# EAGLE design 2018-07-20 Shutters Signal Isolator (EAGLE 9.1.1)
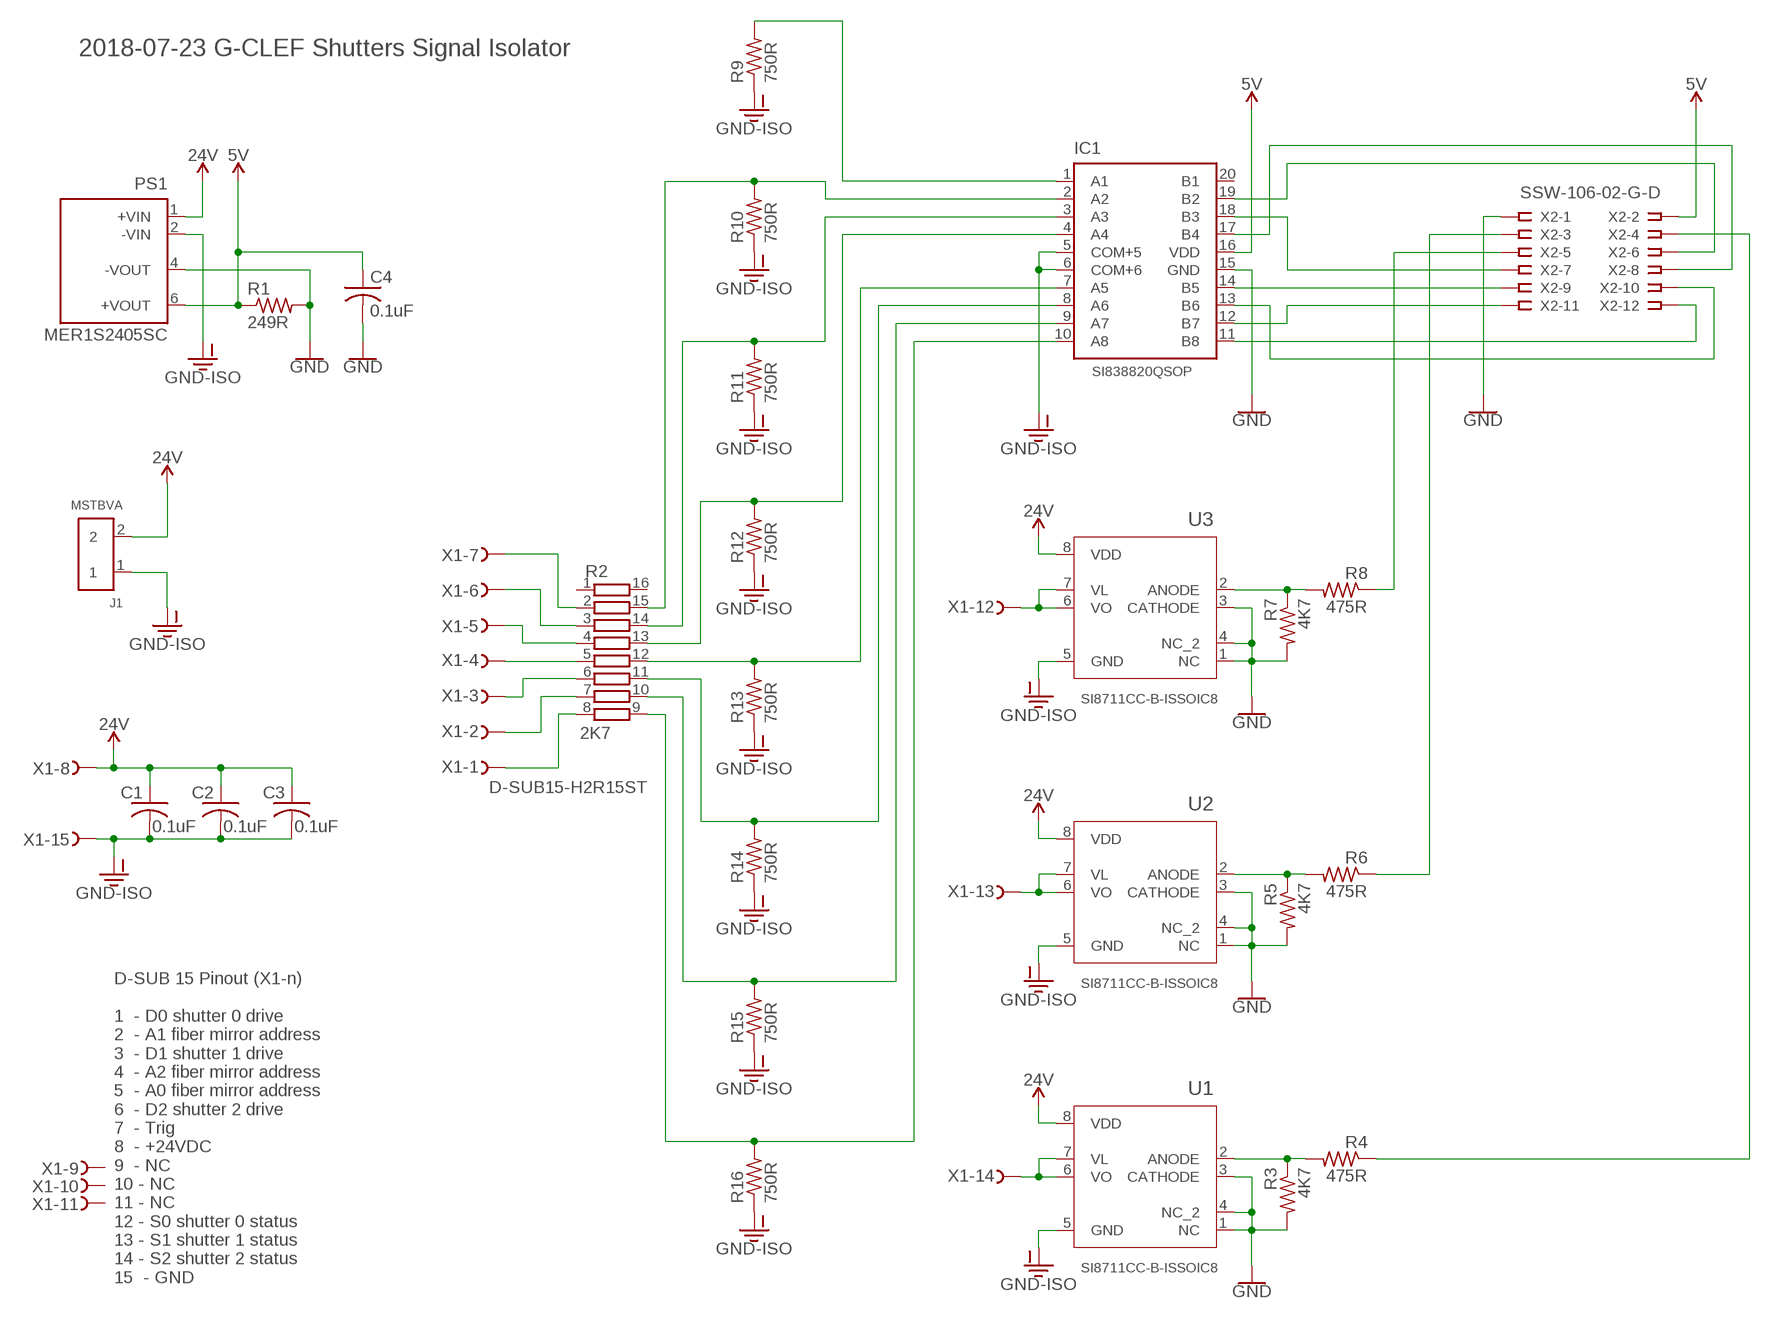
[diagram p0: schematic, sheet 1]

## Parts
C1  0.1uF  C-USC0805  [C0805]
C2  0.1uF  C-USC0805  [C0805]
C3  0.1uF  C-USC0805  [C0805]
C4  0.1uF  C-USC0805  [C0805]
IC1  SI838820QSOP  [SOP63P600X175-20]
J1  MSTBVA  [MSTBVA]
PS1  MER1S2405SC  MER1  [MER1]
R1  249R  R-US_R0805  [R0805]
R2  2K7  BOURNS-RES-ARRAY-4816P-T014816P-1  [SOIC127P765X227-16]
R3  4K7  R-US_R0805  [R0805]
R4  475R  R-US_R0805  [R0805]
R5  4K7  R-US_R0805  [R0805]
R6  475R  R-US_R0805  [R0805]
R7  4K7  R-US_R0805  [R0805]
R8  475R  R-US_R0805  [R0805]
R9  750R  R-US_R0805  [R0805]
R10  750R  R-US_R0805  [R0805]
R11  750R  R-US_R0805  [R0805]
R12  750R  R-US_R0805  [R0805]
R13  750R  R-US_R0805  [R0805]
R14  750R  R-US_R0805  [R0805]
R15  750R  R-US_R0805  [R0805]
R16  750R  R-US_R0805  [R0805]
U1  SI8711CC-B-ISSOIC8  [SOIC127P600X175-8]
U2  SI8711CC-B-ISSOIC8  [SOIC127P600X175-8]
U3  SI8711CC-B-ISSOIC8  [SOIC127P600X175-8]
X1  D-SUB15-H2R15ST  [H2R15ST]
X2  SSW-106-02-G-D  [SSW-106-02-G-D]

## Nets
5V [pwr]: C4.1 IC1.16(VDD) PS1.6(+VOUT) R1.1 X2.2
24V [pwr]: C1.1 C2.1 C3.1 J1.2 PS1.1(+VIN) U1.8(VDD) U2.8(VDD) U3.8(VDD) X1.8
GND: C4.2 IC1.15(GND) PS1.4(-VOUT) R1.2 R3.2 R5.2 R7.2 U1.1(NC) U1.3(CATHODE) U1.4(NC_2) U2.1(NC) U2.3(CATHODE) U2.4(NC_2) U3.1(NC) U3.3(CATHODE) U3.4(NC_2) X2.1
GND-ISO [pwr]: C1.2 C2.2 C3.2 IC1.5(COM+5) IC1.6(COM+6) J1.1 PS1.2(-VIN) R9.1 R10.1 R11.1 R12.1 R13.1 R14.1 R15.1 R16.1 U1.5(GND) U2.5(GND) U3.5(GND) X1.15
N$2: IC1.1(A1) R9.2
N$4: IC1.2(A2) R2.15 R10.2
N$5: IC1.11(B8) X2.12
N$6: IC1.12(B7) X2.11
N$7: IC1.3(A3) R2.14 R11.2
N$8: IC1.13(B6) X2.10
N$9: IC1.14(B5) X2.9
N$10: IC1.19(B2) X2.6
N$11: IC1.17(B4) X2.8
N$12: IC1.18(B3) X2.7
N$13: R2.8 X1.1
N$14: IC1.4(A4) R2.13 R12.2
N$15: R2.7 X1.2
N$16: IC1.7(A5) R2.12 R13.2
N$17: R2.6 X1.3
N$18: IC1.8(A6) R2.11 R14.2
N$21: IC1.9(A7) R2.10 R15.2
N$22: IC1.10(A8) R2.9 R16.2
N$23: R2.5 X1.4
N$24: R2.2 X1.7
N$25: R2.3 X1.6
N$26: R2.4 X1.5
N$27: R6.1 X2.3
N$28: R3.1 R4.2 U1.2(ANODE)
N$30: U1.6(VO) U1.7(VL) X1.14
N$31: R5.1 R6.2 U2.2(ANODE)
N$32: U2.6(VO) U2.7(VL) X1.13
N$33: R7.1 R8.2 U3.2(ANODE)
N$35: U3.6(VO) U3.7(VL) X1.12
S$0: R8.1 X2.5
S$2: R4.1 X2.4
Unconnected: IC1.20(B1) R2.1 R2.16 X1.9 X1.10 X1.11

## Notes on the sheet
- 2018-07-23 G-CLEF Shutters Signal Isolator
- D-SUB 15 Pinout (X1-n)
  
  1  - D0 shutter 0 drive
  2  - A1 fiber mirror address
  3  - D1 shutter 1 drive
  4  - A2 fiber mirror address
  5  - A0 fiber mirror address
  6  - D2 shutter 2 drive
  7  - Trig
  8  - +24VDC
  9  - NC
  10 - NC
  11 - NC
  12 - S0 shutter 0 status
  13 - S1 shutter 1 status
  14 - S2 shutter 2 status
  15  - GND

## Library data of the parts
C1-C4 = rcl:C-US: CAPACITOR, American symbol; SPICEPREFIX: C
IC1 = AUmlib:SI8388: Si8388 Silicon Labs Digital Input 8-port 24V to 5V with isolation
J1 = AU:MSTBVA: Phoenix Contact MSTBVA Vertical Terminal Block Phoenix order number 1755736 Digikey: 277-1150-ND Mating part is Phoneix Contact Combicon Spring Cage plug TFCK 5.08 mm pitch Digikey: 277-6941-ND
PS1 = AU:MER1
R1 R3-R16 = rcl:R-US_: RESISTOR, American symbol; SPICEPREFIX: R
R2 = AUmlib:BOURNS-RES-ARRAY-4816P-T01: BOURNS RESISTOR NETWORK
U1-U3 = AUmlib:SI8711CC-B-IS
X1 = con-thomas-betts:D-SUB15-: D-Subminiatur Connector Source: Electronioc Interconnects European Edition 1998; OC_FARNELL: unknown; OC_NEWARK: unknown
X2 = AUmlib:SSW-106-02-G: THROUGH-HOLE .025" SQ POST SOCKET Source: Samtec SSW.pdf; MF: Samtec Inc.; MPN: SSW-106-02-G-D; OC_FARNELL: unknown; OC_NEWARK: 11P9414

## Net classes
1 pwr: width 0.254 mm, clearance 0.254 mm

## Board
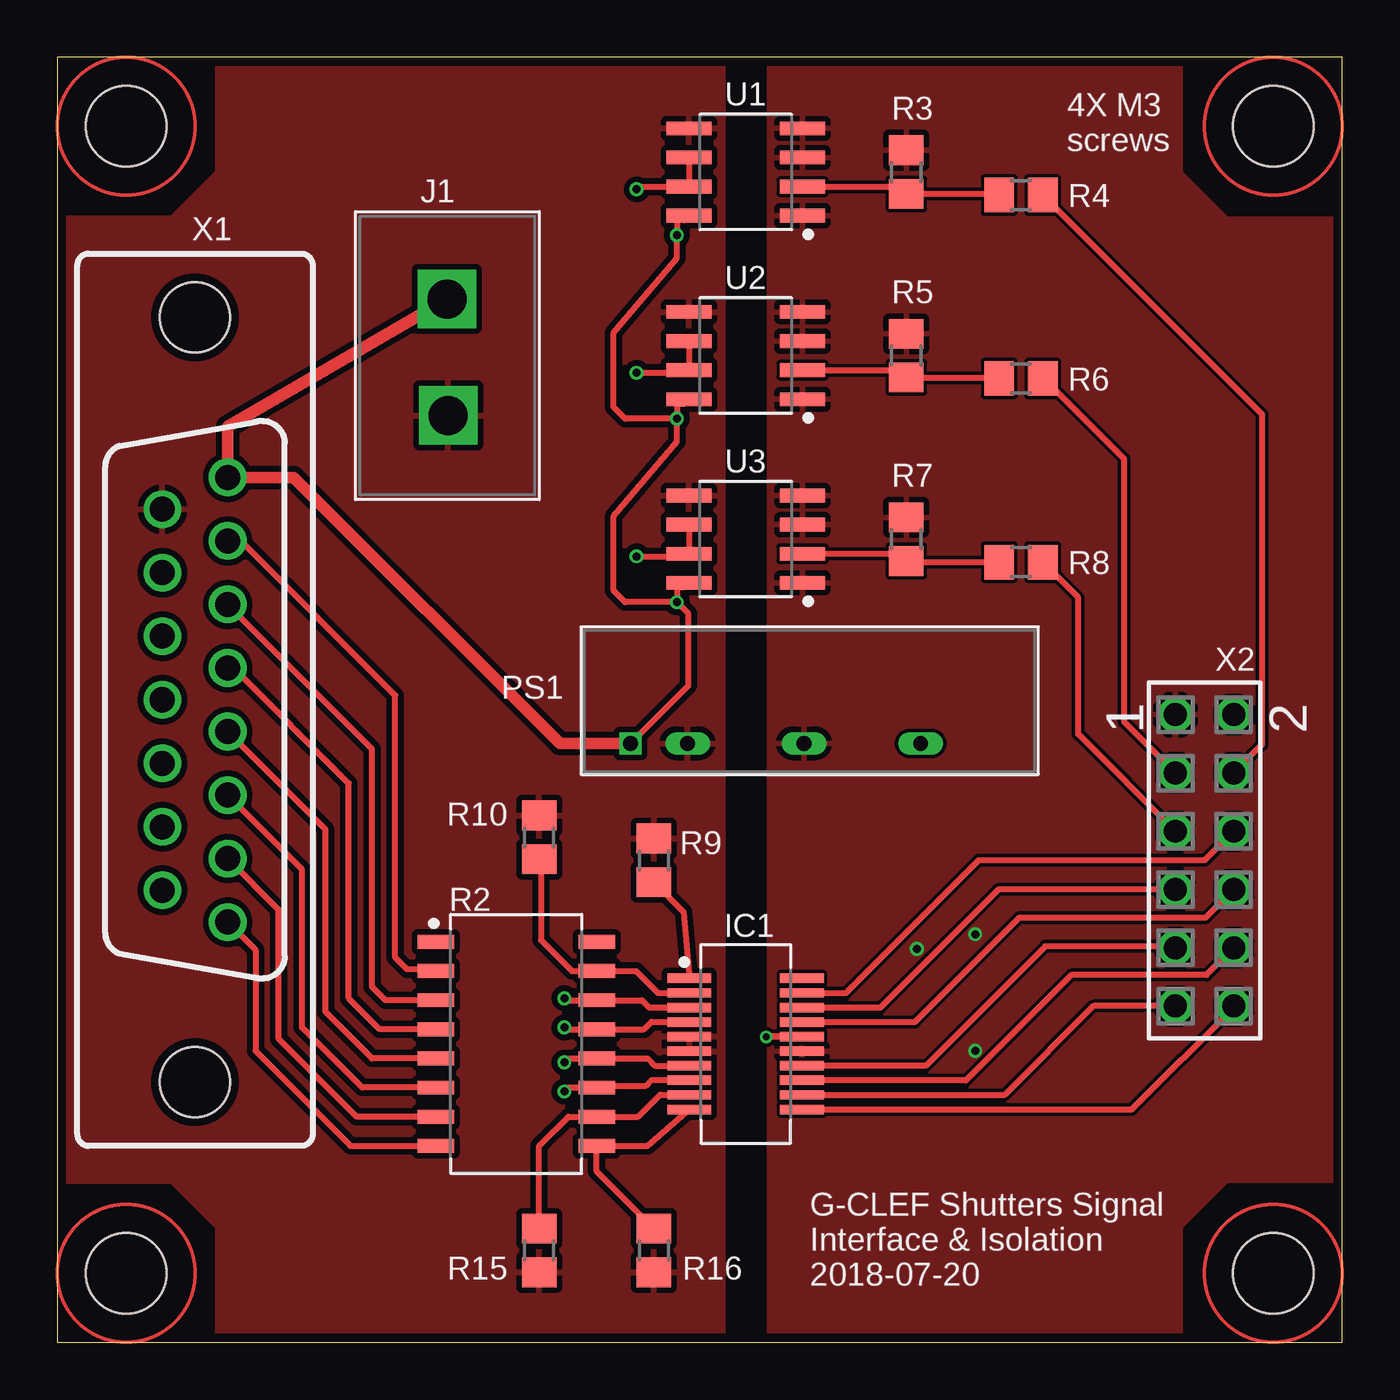
[diagram p1: board, top side]
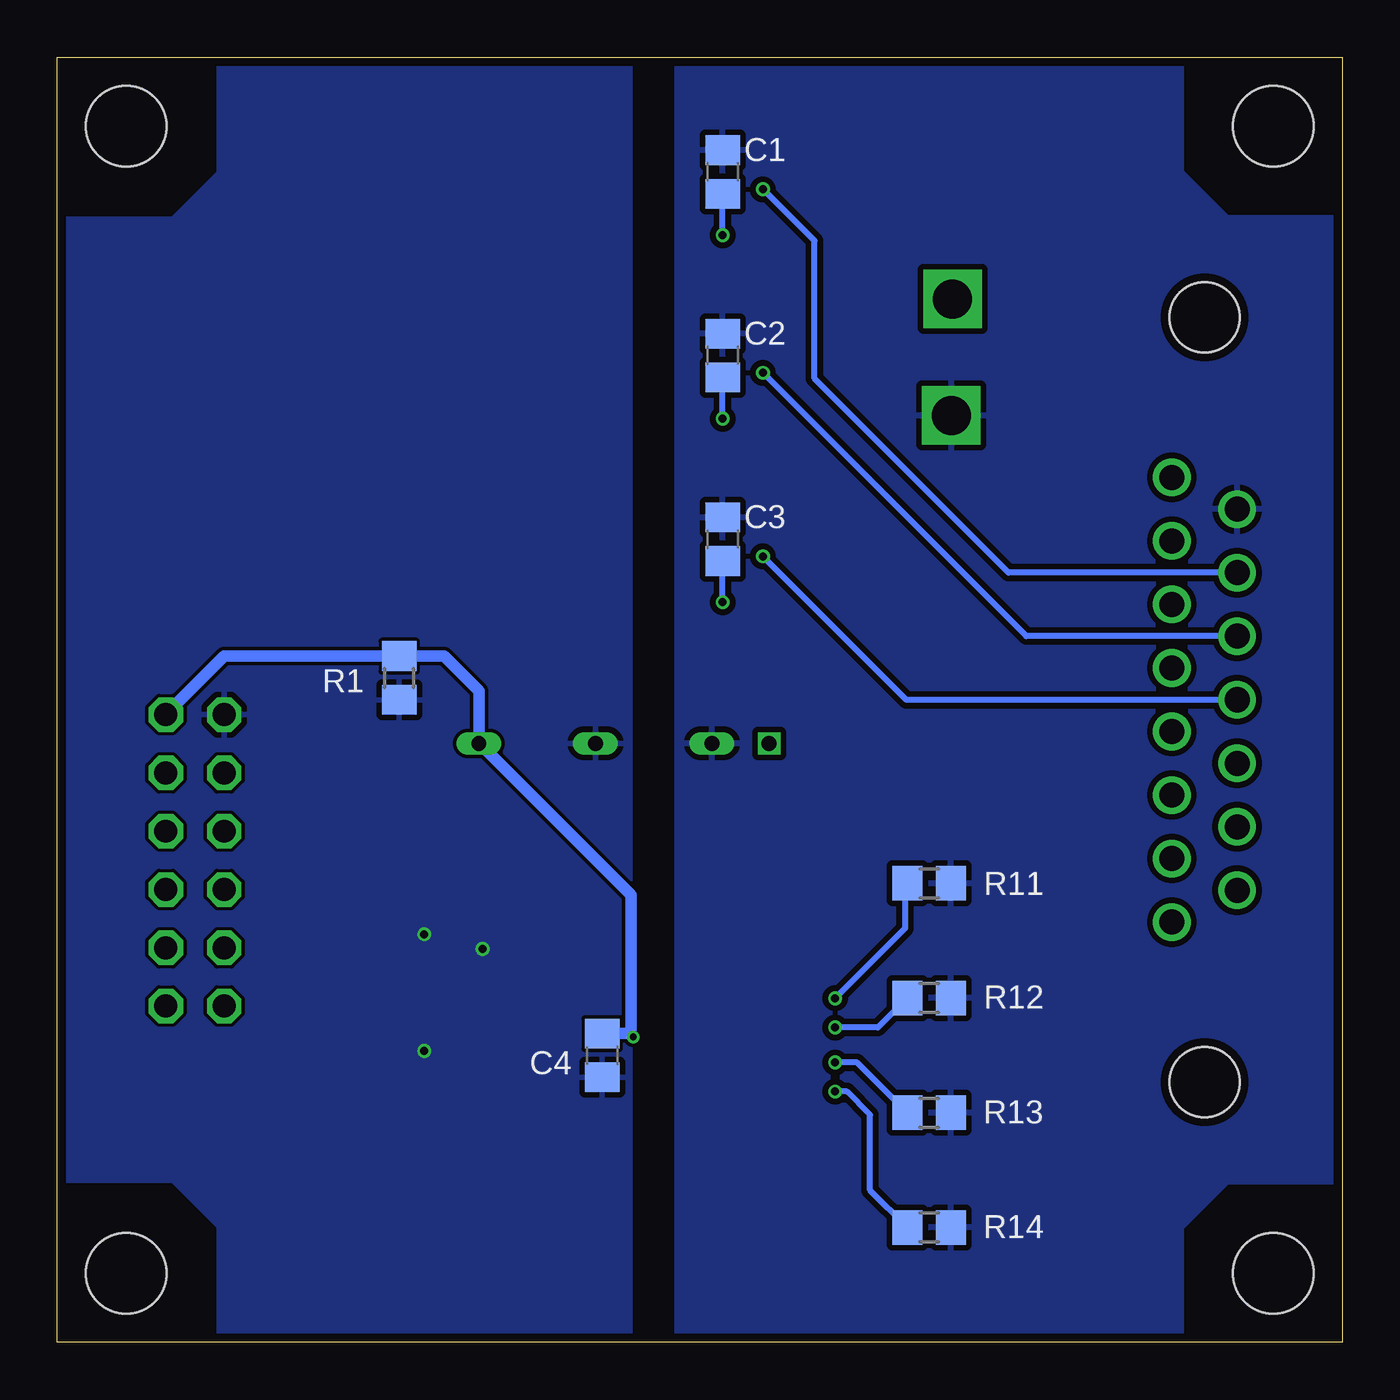
[diagram p2: board, bottom side, seen from below]

Size 56 x 56 mm. Coordinates in mm from the lower left corner, seen from the top.
Outline: 0,0 56,0 56,56 0,56 0,0
Copper layers (1*16): Top 0.035559375mm / dielectric 1.6mm / Bottom 0.035559375mm
Design rules "oshpark-2layer": minimum track width 6mil, minimum drill 10mil, track to track 6mil, track to pad 6mil, pad to pad 6mil, via to via 6mil, smd to smd 6mil, copper to edge 15mil, drill to drill 6mil, minimum pad ring 5mil, minimum via ring 5mil, stop-mask expansion 2.5mil, vias tented up to drill 0mil, thermal gap 10mil
Holes 3.5 mm at 3,3 3,53 53,53 53,3

### Footprints (pad centres in the part's own frame; a part is rotated, then mirrored left to right if it is on the bottom)
C0805 = smd 1.3 x 1.5: 1 -0.95,0; 2 0.95,0
SOP63P600X175-20 = smd 1.901 x 0.41: 1 -2.455,2.857; 2 -2.455,2.223; 3 -2.455,1.587; 4 -2.455,0.953; 5 -2.455,0.318; 6 -2.455,-0.318; 7 -2.455,-0.953; 8 -2.455,-1.587; 9 -2.455,-2.223; 10 -2.455,-2.857; 11 2.455,-2.857; 12 2.455,-2.223; 13 2.455,-1.587; 14 2.455,-0.953; 15 2.455,-0.318; 16 2.455,0.318; 17 2.455,0.953; 18 2.455,1.587; 19 2.455,2.223; 20 2.455,2.857
MSTBVA = drill 1.7 square: 1 -2.61,-0.04; 2 2.47,0.02
MER1 = drill 0.65 square: 1 -7.62,-1.905 | drill 0.65 long: 2 -5.131,-1.905; 4 -0.051,-1.905; 6 5.029,-1.905
R0805 = smd 1.3 x 1.5: 1 -0.95,0; 2 0.95,0
SOIC127P765X227-16 = smd 1.588 x 0.605: 1 -3.512,4.445; 2 -3.512,3.175; 3 -3.512,1.905; 4 -3.512,0.635; 5 -3.512,-0.635; 6 -3.512,-1.905; 7 -3.512,-3.175; 8 -3.512,-4.445; 9 3.512,-4.445; 10 3.512,-3.175; 11 3.512,-1.905; 12 3.512,-0.635; 13 3.512,0.635; 14 3.512,1.905; 15 3.512,3.175; 16 3.512,4.445
SOIC127P600X175-8 = smd 1.968 x 0.602: 1 -2.473,1.905; 2 -2.473,0.635; 3 -2.473,-0.635; 4 -2.473,-1.905; 5 2.473,-1.905; 6 2.473,-0.635; 7 2.473,0.635; 8 2.473,1.905
H2R15ST = drill 1.092: 1 9.69,1.422; 2 6.921,1.422; 3 4.153,1.422; 4 1.384,1.422; 5 -1.384,1.422; 6 -4.153,1.422; 7 -6.921,1.422; 8 -9.69,1.422; 9 8.306,-1.422; 10 5.537,-1.422; 11 2.769,-1.422; 12 0,-1.422; 13 -2.769,-1.422; 14 -5.537,-1.422; 15 -8.306,-1.422 | hole 3.048: -16.662,0; 16.662,0
SSW-106-02-G-D = drill 1 pad 1.5 octagon: 1 -6.35,-1.27; 2 -6.35,1.27; 3 -3.81,-1.27; 4 -3.81,1.27; 5 -1.27,-1.27; 6 -1.27,1.27; 7 1.27,-1.27; 8 1.27,1.27; 9 3.81,-1.27; 10 3.81,1.27; 11 6.35,-1.27; 12 6.35,1.27

### Placement (x,y rotation side)
C1  27,51 90 bottom
C2  27,43 90 bottom
C3  27,35 90 bottom
C4  32.25,12.5 270 bottom
IC1  30,13 0 top
J1  17,43 90 top
PS1  32.6,28 0 top
R1  41.1,28.95 270 bottom
R2  20,13 0 top
R3  37,51 90 top
R4  42,50 180 top
R5  37,43 90 top
R6  42,42 180 top
R7  37,35 90 top
R8  42,34 180 top
R9  26,21 270 top
R10  21,22 270 top
R11  18,20 180 bottom
R12  18,15 180 bottom
R13  18,10 180 bottom
R14  18,5 180 bottom
R15  21,4 90 top
R16  26,4 90 top
U1  30,51 180 top
U2  30,43 180 top
U3  30,35 180 top
X1  6,28 270 top
X2  50,21 270 top

### Tracks (layer width: path | path; a pad name or v marks a point on that pad's centre or on a via)
5V  (via drill 0.3)
  Top 0.305: IC1.16 v30.9,13.3
  Bottom 0.254: 31,13.4 v30.9,13.3 31.05,13.45 | 37.59,26.09 PS1.6
  Bottom 0.508: 31,13.4 31,19.5 37.59,26.09 | PS1.6 37.63,28.38 39.15,29.9 R1.1 48.72,29.9 X2.2 | 31.05,13.45 C4.1
24V  (via drill 0.35)
  Top 0.254: v27,32.25 27,32.9 27.33,32.9 U3.8 | v27,40.25 27,40.9 27.33,40.9 U2.8 | v27,32.25 24.75,32.25 24.25,32.75 24.25,36 27,39.25 v27,40.25 | v27,40.25 24.75,40.25 24.25,40.75 24.25,44 27,47.25 v27,48.25 27,48.9 27.33,48.9 U1.8 | v27,32.25 27.5,31.75 27.5,28.61 PS1.1
  Top 0.508: J1.2 7.42,39.91 X1.8 10.31,37.69 21.91,26.09 PS1.1
  Bottom 0.254: v27,32.25 C3.1 | v27,40.25 C2.1 | v27,48.25 C1.1
GND  (via drill 0.35)
  other vias: 37.47,17.14 40.01,17.78 40.01,12.7
  pour Top: 31,0 49,0 49,5 51,7 56,7 56,49 51,49 49,51 49,56 31,56
  pour Bottom: 31,0 49,0 49,5 51,7 56,7 56,49 51,49 49,51 49,56 31,56
GND-ISO
  pour Bottom: 7,5 5,7 0,7 0,49 5,49 7,51 7,56 29,56 29,0 7,0
  pour Top: 7,5 5,7 0,7 0,49 5,49 7,51 7,56 29,56 29,0 7,0
N$2
  Top 0.254: R9.2 27.3,18.75 IC1.1
N$4
  Top 0.254: R10.2 21.08,20.97 21.08,17.53 22.43,16.18 R2.15 25.23,16.18 26.18,15.22 IC1.2
N$5
  Top 0.254: IC1.11 46.83,10.14 51.27,14.58 X2.12
N$6
  Top 0.254: IC1.12 41.3,10.78 45.16,14.65 X2.11
N$7  (via drill 0.35)
  Top 0.254: IC1.3 25.8,14.59 25.48,14.9 R2.14 22.18,14.9 v22.1,14.99
  Bottom 0.254: R11.2 19.05,19.9 19.05,18.03 v22.1,14.99
N$8
  Top 0.254: IC1.13 39.6,11.41 44.19,16 50.08,16 X2.10
N$9
  Top 0.254: IC1.14 37.85,12.05 43.05,17.25 48.03,17.25 48.09,17.19 X2.9
N$10
  Top 0.254: IC1.19 34.37,15.22 40.15,21 50,21 X2.6
N$11
  Top 0.254: IC1.17 37.37,13.95 41.92,18.5 50.04,18.5 X2.8
N$12
  Top 0.254: IC1.18 35.88,14.59 41.02,19.73 X2.7
N$13
  Top 0.254: X1.1 8.64,17.1 8.64,12.7 12.78,8.55 R2.8
N$14  (via drill 0.35)
  Top 0.254: IC1.4 27.28,13.97 25.91,13.97 25.57,13.63 R2.13 22.18,13.63 v22.1,13.72
  Bottom 0.254: R12.2 20.23,13.72 v22.1,13.72
N$15
  Top 0.254: R2.7 13.04,9.82 9.65,13.21 9.65,18.85 X1.2
N$16  (via drill 0.35)
  Top 0.254: IC1.7 26.05,12.05 25.73,12.37 R2.12 22.27,12.37 v22.1,12.19
  Bottom 0.254: R13.2 21.14,12.19 v22.1,12.19
N$17
  Top 0.254: R2.6 13.29,11.1 10.67,13.72 10.67,20.6 X1.3
N$18  (via drill 0.35)
  Top 0.254: IC1.8 27.28,11.43 25.91,11.43 25.65,11.18 23.59,11.18 R2.11 22.27,11.1 v22.1,10.92
  Bottom 0.254: R14.2 20.57,6.62 20.57,9.91 21.59,10.92 v22.1,10.92
N$21
  Top 0.254: IC1.9 26.27,10.78 25.32,9.82 R2.10 22.27,9.82 21,8.55 R15.2
N$22
  Top 0.254: IC1.10 25.71,8.55 R2.9 23.51,7.44 R16.2
N$23
  Top 0.254: X1.4 11.68,22.35 11.68,14.4 13.72,12.37 R2.5
N$24
  Top 0.254: R2.2 16.41,16.26 15.24,16.26 14.73,16.76 14.73,28.19 8.01,34.92 X1.7
N$25
  Top 0.254: R2.3 14.3,14.9 13.72,15.49 13.72,25.86 X1.6
N$26
  Top 0.254: R2.4 14.05,13.63 12.7,14.99 12.7,24.36 7.68,29.38 X1.5
N$27
  Top 0.254: X2.3 46.5,27.04 46.5,38.5 43,42 R6.1
N$28
  Top 0.254: U1.2 36.69,50.37 R3.1 41,50.05 R4.2
N$30  (via drill 0.35)
  Top 0.254: v25.25,50.25 25.36,50.37 U1.7 U1.6
  Bottom 0.254: X1.14 14.54,33.54 23,42 23,48 v25.25,50.25
N$31
  Top 0.254: U2.2 36.69,42.37 R5.1 41,42.05 R6.2
N$32  (via drill 0.35)
  Top 0.254: v25.25,42.25 27.41,42.25 U2.7 U2.6
  Bottom 0.254: X1.13 13.77,30.77 v25.25,42.25
N$33
  Top 0.254: R7.1 37.05,34 | 37.05,34 R8.2 | U3.2 36.69,34.37 37.05,34
N$35  (via drill 0.35)
  Top 0.254: v25.25,34.25 27.41,34.25 U3.7 U3.6
  Bottom 0.254: X1.12 19,28 v25.25,34.25
S$0
  Top 0.254: X2.5 44.5,26.5 44.5,32.45 R8.1
S$2
  Top 0.254: X2.4 52.5,26.04 52.5,40.45 R4.1
(copper drawn outside any net)
  shapes: Top circle x4

### Text on the board
tPlace: 4X M3 / screws | G-CLEF Shutters Signal / Interface & Isolation / 2018-07-20